# Altium schematic sheet DEPTHAI_CAM_INTERFACE.SchDoc: =project_title
size Tabloid; CompanyName: Luxonis Holding; Organization: Luxonis Holding; Address1: 1925 Harmony Park Drive; Address2: Westminster, CO; Address3: 80234; Address4: United States; SheetNumber: 6; SheetTotal: 6
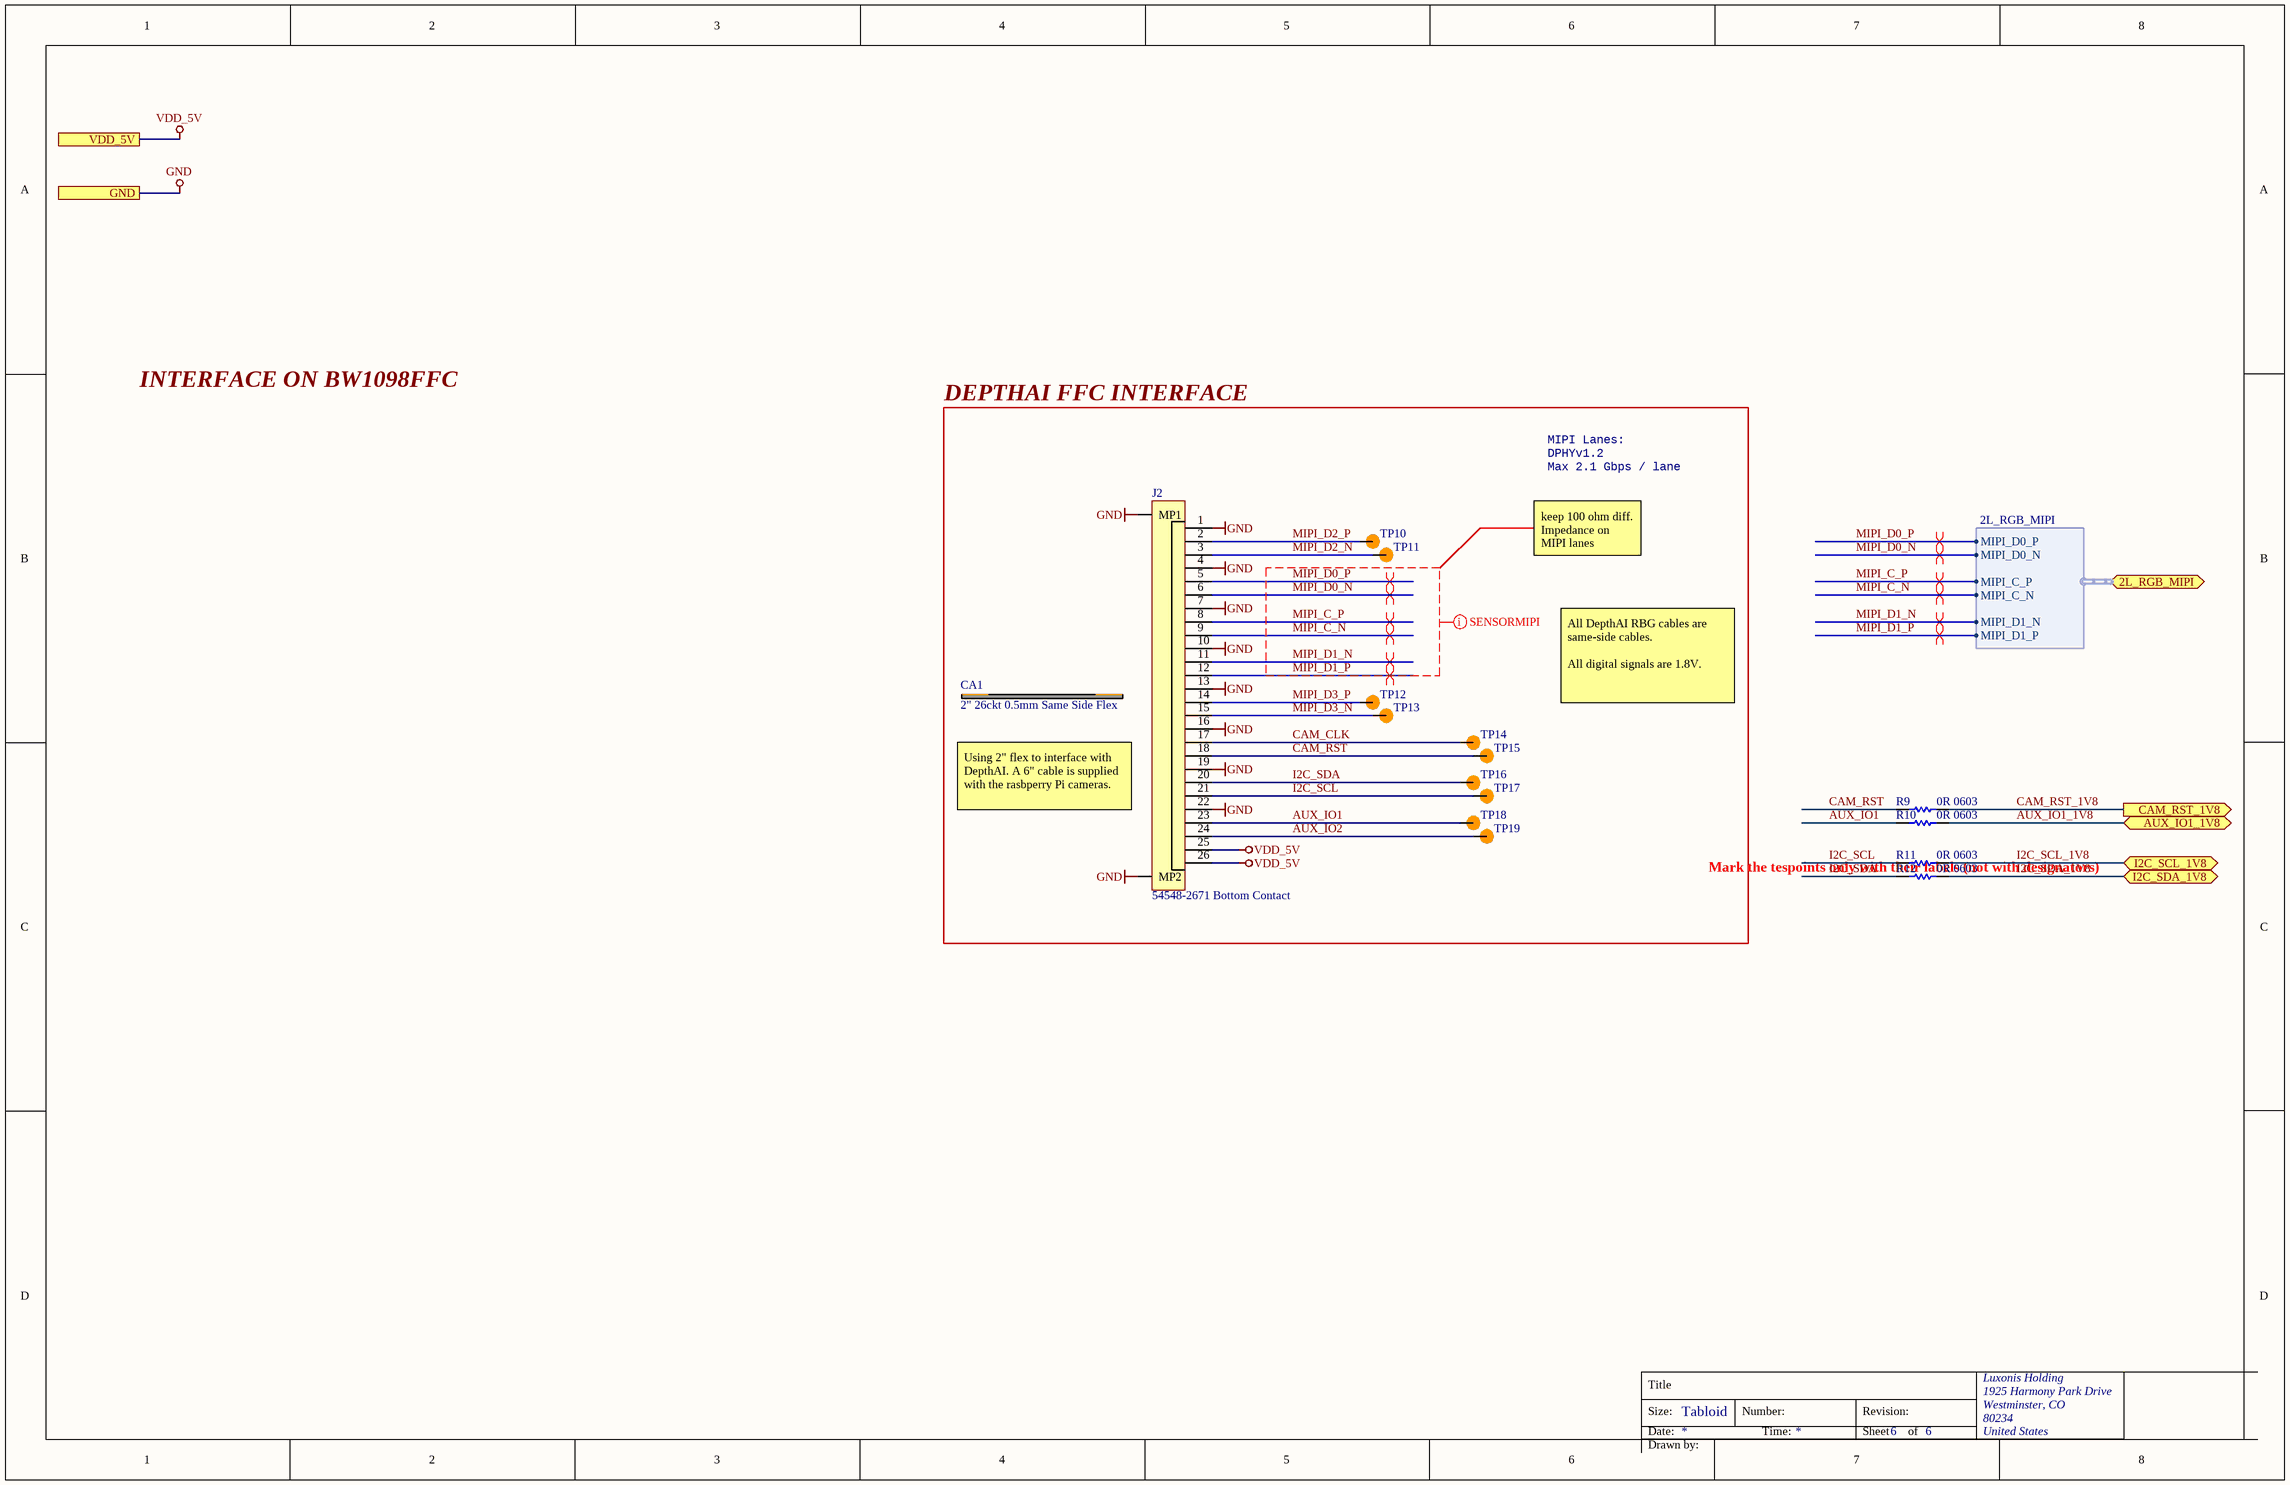
[diagram p0: DEPTHAI_CAM_INTERFACE.SchDoc]

## Parts
CA1  2" 26ckt 0.5mm Same Side Flex
J2  54548-2671 Bottom Contact  [54548-2671]
R9  0R 0603  [RESC0603(1608)_M]
R10  0R 0603  [RESC0603(1608)_M]
R11  0R 0603  [RESC0603(1608)_M]
R12  0R 0603  [RESC0603(1608)_M]
TP10  TP075_150_NS  [TP075_150_NS]  (value not drawn)  (no BOM)
TP11  TP075_150_NS  [TP075_150_NS]  (value not drawn)  (no BOM)
TP12  TP075_150_NS  [TP075_150_NS]  (value not drawn)  (no BOM)
TP13  TP075_150_NS  [TP075_150_NS]  (value not drawn)  (no BOM)
TP14  TP100_150_NS  [TP100_150_NS]  (value not drawn)  (no BOM)
TP15  TP100_150_NS  [TP100_150_NS]  (value not drawn)  (no BOM)
TP16  TP100_150_NS  [TP100_150_NS]  (value not drawn)  (no BOM)
TP17  TP100_150_NS  [TP100_150_NS]  (value not drawn)  (no BOM)
TP18  TP100_150_NS  [TP100_150_NS]  (value not drawn)  (no BOM)
TP19  TP100_150_NS  [TP100_150_NS]  (value not drawn)  (no BOM)

## Blocks framed on the sheet
DEPTHAI FFC INTERFACE: CA1 J2 TP10-TP19

## Ports
2L_RGB_MIPI (bidir, harness 2L_RGB_MIPI), AUX_IO1_1V8 (bidir), CAM_RST_1V8 (out), GND, I2C_SCL_1V8 (bidir), I2C_SDA_1V8 (bidir), VDD_5V

## Harnesses
2L_RGB_MIPI: MIPI_D0_P, MIPI_D0_N, MIPI_C_P, MIPI_C_N, MIPI_D1_N, MIPI_D1_P

## Nets
GND: J2.1 J2.4 J2.7 J2.10 J2.13 J2.16 J2.19 J2.22 J2.MP1 J2.MP2 ; port GND
VDD_5V: J2.25 J2.26 ; port VDD_5V
AUX_IO1: J2.23 R10.1 TP18.1
AUX_IO1_1V8: R10.2 ; port AUX_IO1_1V8
AUX_IO2: J2.24 TP19.1
CAM_CLK: J2.17 TP14.1
CAM_RST: J2.18 R9.1 TP15.1
CAM_RST_1V8: R9.2 ; port CAM_RST_1V8
I2C_SCL: J2.21 R11.1 TP17.1
I2C_SCL_1V8: R11.2 ; port I2C_SCL_1V8
I2C_SDA: J2.20 R12.1 TP16.1
I2C_SDA_1V8: R12.2 ; port I2C_SDA_1V8
MIPI_C_N: J2.9 ; port 2L_RGB_MIPI.MIPI_C_N
MIPI_C_P: J2.8 ; port 2L_RGB_MIPI.MIPI_C_P
MIPI_D0_N: J2.6 ; port 2L_RGB_MIPI.MIPI_D0_N
MIPI_D0_P: J2.5 ; port 2L_RGB_MIPI.MIPI_D0_P
MIPI_D1_N: J2.11 ; port 2L_RGB_MIPI.MIPI_D1_N
MIPI_D1_P: J2.12 ; port 2L_RGB_MIPI.MIPI_D1_P
MIPI_D2_N: J2.3 TP11.1
MIPI_D2_P: J2.2 TP10.1
MIPI_D3_N: J2.15 TP13.1
MIPI_D3_P: J2.14 TP12.1

## Layout directives
net class SENSORMIPI: MIPI_C_N, MIPI_C_P, MIPI_D0_N, MIPI_D0_P, MIPI_D1_N, MIPI_D1_P
differential pair: MIPI_C_N, MIPI_C_P, MIPI_D0_N, MIPI_D0_P, MIPI_D1_N, MIPI_D1_P

## Notes on the sheet
- INTERFACE ON BW1098FFC
- MIPI Lanes:
- Max 2.1 Gbps / lane
- DPHYv1.2
- keep 100 ohm diff. Impedance on MIPI lanes
- All DepthAI RBG cables are same-side cables.
  All digital signals are 1.8V.
- (near J2) Using 2" flex to interface with DepthAI. A 6" cable is supplied with the rasbperry Pi cameras.
- Mark the tespoints only with their labels (not with designators)
- Title
- Size:
- Date:
- Tabloid
- Number:
- Time:
- Revision:
- Sheet
- of
- Drawn by:

## Library data of the parts
CA1 = 0151660273: FFC 0.50 TYPE A 26 CKTS LGT 51; Manufacturer 1: Molex; Number of Conductors: 26; Wire/Cable Type: Flat Flex; Pitch: 0.02inch; Supplier 1: Digi-Key; Manufacturer Part Number 1: 0151660273; Stock 1: 738; Pricing 1: 1=2.00000, 10=1.81500, 25=1.70400, 50=1.63000, 100=1.55590, 250=1.40772, 500=1.29658, 1000=1.11135, 2500=1.03726 (USD); RoHS: Yes; Number of Pins: 26; Packaging: Bulk; Package Quantity: 1000; Length: 2inch; Cable Pitch: 0.5mm; Radiation Hardening: No; ComponentLink1URL: https://datasheet.ciiva.com/10989/0151660273-cable-10989027.pdf?src-supplier=Avnet; ComponentLink1Description: https://datasheet.ciiva.com/10989/0151660273-cable-10989027.pdf?src-supplier=Avnet; ComponentLink2URL: https://datasheet.ciiva.com/2944/151660051-sd-2944368.pdf?src-supplier=Digi-Key; ComponentLink2Description: https://datasheet.ciiva.com/2944/151660051-sd-2944368.pdf?src-supplier=Digi-Key; Supplier 2: Mouser; Supplier Part Number 1: WM11306-ND; Supplier Part Number 2: 538-15166-0273; Category: Cables and Wire
J2 = 54548-2671: CONN FFC BOTTOM 26POS 0.50MM R/A 26 Position FFC, FPC Connector Contacts, Bottom 0.020" (0.50mm) Surface Mount, Right Angle; Manufacturer_Name: Molex; Actuator Material: Polyphenylene; Current Rating: 500mA; Voltage Rating: 50V; Contact Resistance: 40mR; Number of Positions: 26; Wire/Cable Type: Straight; Pitch: 0.5mm; Datasheet Link: https://www.molex.com/molex/products/datasheet.jsp?part=active/0545482671_FFC_FPC_CONNECTORS.xml&channel=Products&Lang=en-US; Height: 1mm; Manufacturer_Part_Number: 54548-2671; Mouser Part Number: 538-54548-2671; Mouser Price/Stock: https://eu.mouser.com/ProductDetail/Molex/54548-2671?qs=sGAEpiMZZMs7i6cT6ogu49DbkzKdWzYdwOJCTNigfgU%3D; RoHS: Yes; Mount: Surface Mount; Contact Material: Bronze; Contact Plating: Gold; Housing Material: Polymer; Housing Color: Black; Min Operating Temperature: -20°C; Max Operating Temperature: 85°C; Number of Rows: 1; Package Quantity: 750; Packaging: Tape and Reel; Termination: Solder; Number of Contacts: 26; Orientation: Right Angle; Length: 18.2mm; Depth: 5mm; Flammability Rating: UL94 V-0; ComponentLink1URL: https://datasheet.ciiva.com/5137/0545482671-ffc-fpc-connectors-146697-5137857.pdf?src-supplier=Mouser; ComponentLink1Description: https://datasheet.ciiva.com/5137/0545482671-ffc-fpc-connectors-146697-5137857.pdf?src-supplier=Mouser; Supplier 1: Mouser; Manufacturer 1: Molex; Manufacturer Part Number 1: 54548-2671; Stock 1: 6344; Pricing 1: 1=3.03000, 10=2.86000, 25=2.55000, 100=2.42000, 250=2.12000, 500=2.07000 (USD); Supplier 2: Arrow; Manufacturer 2: Molex; Manufacturer Part Number 2: 54548-2671; Stock 2: 11173; Pricing 2: 1=3.50200, 10=3.34800, 25=3.06600, 100=2.78390, 250=2.43800, 500=2.41400, 1000=2.25990, 3000=2.10600, 6000=1.95200, 12000=1.73300, 24000=1.71600, 48000=1.69900, 60000=1.68200 (USD); Supplier Part Number 2: 0545482671; Supplier Part Number 1: 538-54548-2671; System: Connector
R9-R12 = CRCW06030000Z0EA: RES SMD 0 OHM JUMPER 1/10W 0603 0 Ohms Jumper 0.1W, 1/10W Chip Resistor 0603 (1608 Metric) Automotive AEC-Q200 Thick Film; Manufacturer 1: Vishay; Manufacturer Part Number 1: CRCW0603-0000Z0EA; Resistance: 0mR; Power Rating: 100mW; Voltage Rating: 75V; Temperature Coefficient: 100ppm/°C; Tolerance: 5%; Current Rating: 2A; Supplier 1: Digi-Key; Stock 1: 742743; Pricing 1: 1=0.100000, 10=0.034000, 25=0.024400, 50=0.018600, 100=0.013800, 250=0.010480, 500=0.008400, 1000=0.006180 (USD); RoHS: Yes; Mount: Surface Mount; Case/Package: 0603; Weight: 7.1E-05oz; Contact Plating: Tin,Lead; Case Code (Metric): 1608; Case Code (Imperial): 0603; Min Operating Temperature: -55°C; Max Operating Temperature: 155°C; Composition: Thick Film; Termination: SMD/SMT; Packaging: Tape and Reel; Package Quantity: 1; Number of Terminations: 2; Military Standard: Not; Max Power Dissipation: 100mW; Voltage Rating (DC): 75V; Features: Automotive AEC-Q200; Working Voltage: 75V; Length: 1.55mm; Height: 0.02inch; Width: 0.033inch; Depth: 0.85mm; Radiation Hardening: No; Lead Free: Lead Free; REACH SVHC: Unknown; ComponentLink1URL: https://datasheet.ciiva.com/2461/dcrcwe3-2461968.pdf?src-supplier=Digi-Key; ComponentLink1Description: https://datasheet.ciiva.com/2461/dcrcwe3-2461968.pdf?src-supplier=Digi-Key; ComponentLink2URL: https://datasheet.ciiva.com/2461/dcrcwe3-2461969.pdf?src-supplier=Digi-Key; ComponentLink2Description: https://datasheet.ciiva.com/2461/dcrcwe3-2461969.pdf?src-supplier=Digi-Key; ComponentLink3URL: https://datasheet.ciiva.com/2461/dcrcwe3-2461970.pdf?src-supplier=Digi-Key; ComponentLink3Description: https://datasheet.ciiva.com/2461/dcrcwe3-2461970.pdf?src-supplier=Digi-Key; ComponentLink4URL: https://datasheet.ciiva.com/8340/dcrcwe3-8340197.pdf?src-supplier=Avnet; ComponentLink4Description: https://datasheet.ciiva.com/8340/dcrcwe3-8340197.pdf?src-supplier=Avnet; ComponentLink5URL: https://datasheet.ciiva.com/16941/dcrcw-16941302.pdf?src-supplier=Avnet+Europe; ComponentLink5Description: https://datasheet.ciiva.com/16941/dcrcw-16941302.pdf?src-supplier=Avnet+Europe; ComponentLink6URL: https://datasheet.ciiva.com/16199/dcrcwe3-16199063.pdf?src-supplier=Future+Electronics; ComponentLink6Description: https://datasheet.ciiva.com/16199/dcrcwe3-16199063.pdf?src-supplier=Future+Electronics; ComponentLink7URL: https://datasheet.ciiva.com/16725/70201119-16725175.pdf?src-supplier=Allied+Electronics; ComponentLink7Description: https://datasheet.ciiva.com/16725/70201119-16725175.pdf?src-supplier=Allied+Electronics; ComponentLink8URL: https://datasheet.ciiva.com/26316/fld-crcw-e3-data-en-26316615.pdf?src-supplier=Distrelec; ComponentLink8Description: https://datasheet.ciiva.com/26316/fld-crcw-e3-data-en-26316615.pdf?src-supplier=Distrelec; ComponentLink9URL: https://datasheet.ciiva.com/5544/dcrcwe3-109170-5544344.pdf?src-supplier=Mouser; ComponentLink9Description: https://datasheet.ciiva.com/5544/dcrcwe3-109170-5544344.pdf?src-supplier=Mouser; ComponentLink10URL: https://datasheet.ciiva.com/7841/1720486-7841816.pdf?src-supplier=Element14; ComponentLink10Description: https://datasheet.ciiva.com/7841/1720486-7841816.pdf?src-supplier=Element14; ComponentLink11URL: https://datasheet.ciiva.com/7841/1720486-7841817.pdf?src-supplier=Element14; ComponentLink11Description: https://datasheet.ciiva.com/7841/1720486-7841817.pdf?src-supplier=Element14; ComponentLink12URL: https://datasheet.ciiva.com/7841/125364-7841818.pdf?src-supplier=Element14; ComponentLink12Description: https://datasheet.ciiva.com/7841/125364-7841818.pdf?src-supplier=Element14; ComponentLink13URL: https://datasheet.ciiva.com/16721/70201119-16721450.pdf?src-supplier=Allied+Electronics; ComponentLink13Description: https://datasheet.ciiva.com/16721/70201119-16721450.pdf?src-supplier=Allied+Electronics; Supplier Part Number 1: 541-0.0GCT-ND
TP10-TP19 = TEST_POINT